# Altium schematic sheet Chargeur.SchDoc
size A4; PageSetup: Record=PageOptions|CenterHorizontal=True|CenterVertical=True|PrintScale=0.97|XCorrection=1.00|YCorrection=1.00|PrintKind=1|BorderSize=5000000|LeftOffset=0|BottomOffset=0|Orientation=2|PaperLength=1000|PaperWidth=1000|Scale=100|PaperSource=7|PrintQuality=-3|MediaType=1|DitherType=10|PrintScaleMode=1|PaperKind=A4 (210 x 297 mm)|PaperIndex=9
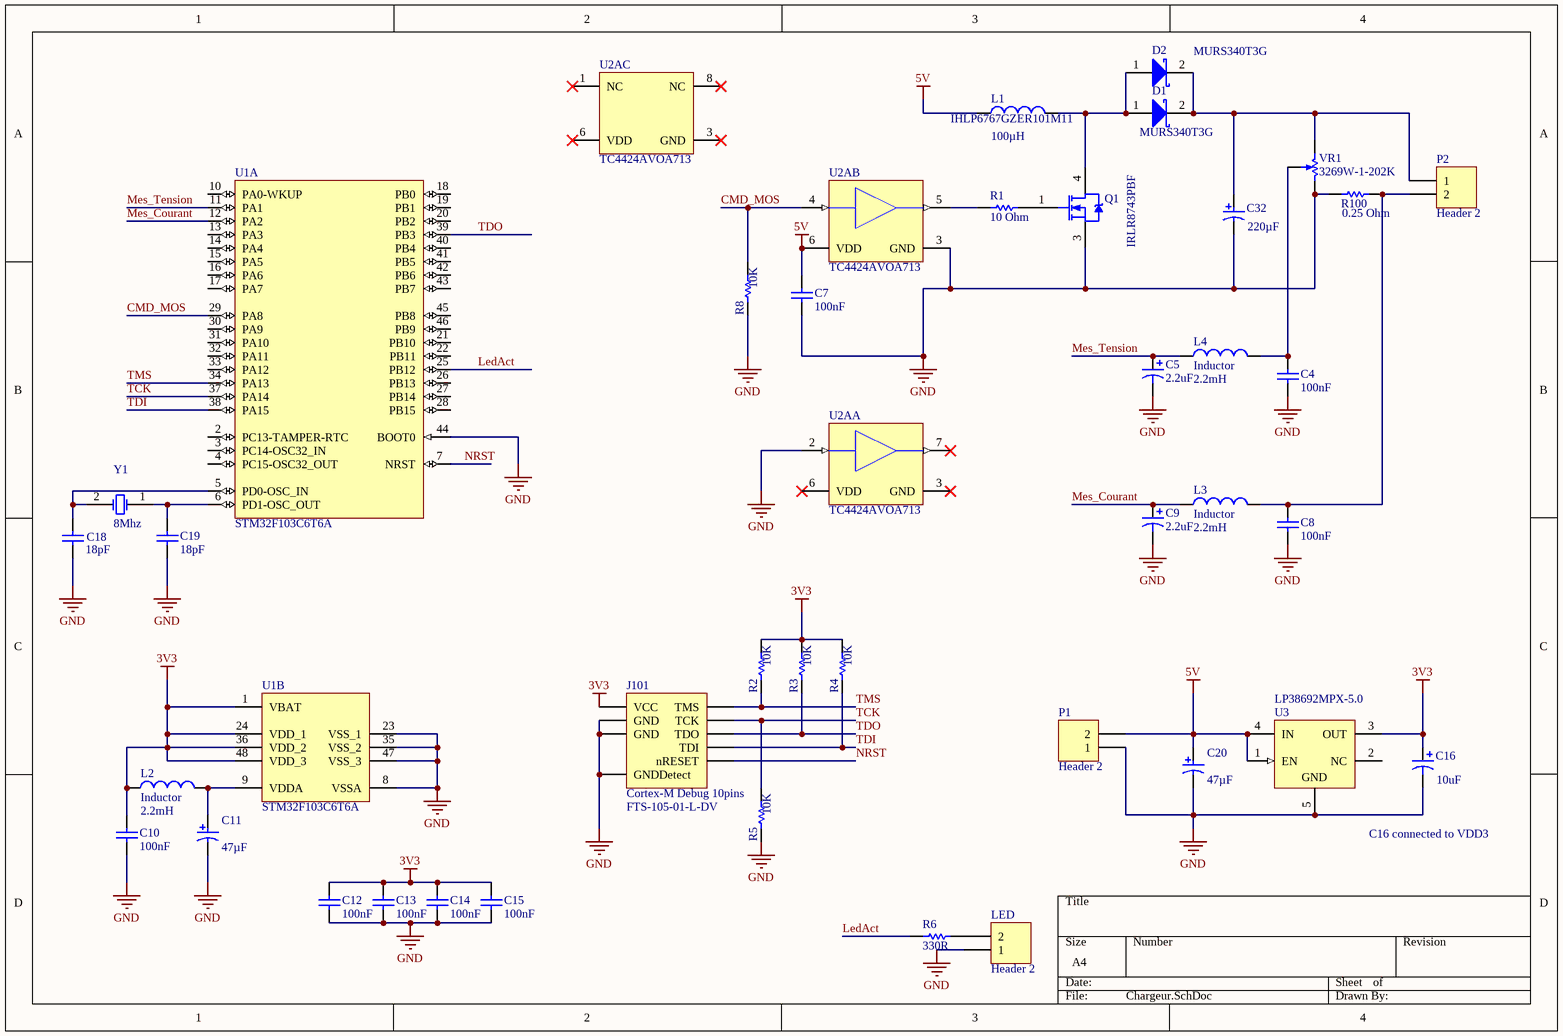
[diagram p0: Chargeur.SchDoc]

## Parts
C4  value 100nF  [CAPC1206(3216)100_L]  (hidden comment: CAP 100nF 25V 1206(3216))
C5  value 2.2uF  [B]  (hidden comment: CC475B004M)
C7  value 100nF  [CAPC1206(3216)100_L]  (hidden comment: CAP 100nF 25V 1206(3216))
C8  value 100nF  [CAPC1206(3216)100_L]  (hidden comment: CAP 100nF 25V 1206(3216))
C9  value 2.2uF  [B]  (hidden comment: CC475B004M)
C10  value 100nF  [CAPC1206(3216)100_L]  (hidden comment: CAP 100nF 25V 1206(3216))
C11  value 47µF  [VISH-7343-31_M]  (hidden comment: 293D476X9016D2TE3)
C12  value 100nF  [CAPC1206(3216)100_L]  (hidden comment: CAP 100nF 25V 1206(3216))
C13  value 100nF  [CAPC1206(3216)100_L]  (hidden comment: CAP 100nF 25V 1206(3216))
C14  value 100nF  [CAPC1206(3216)100_L]  (hidden comment: CAP 100nF 25V 1206(3216))
C15  value 100nF  [CAPC1206(3216)100_L]  (hidden comment: CAP 100nF 25V 1206(3216))
C16  value 10uF  [C]  (hidden comment: 194D335X0015C2)
C18  value 18pF  [CAPC1206(3216)100_L]  (hidden comment: CAP 100nF 25V 1206(3216))
C19  value 18pF  [CAPC1206(3216)100_L]  (hidden comment: CAP 100nF 25V 1206(3216))
C20  value 47µF  [VISH-7343-31_M]  (hidden comment: 293D476X9016D2TE3)
C32  value 220µF  [VISH-7343-31_M]  (hidden comment: 293D476X9016D2TE3)
D1  MURS340T3G  [VISH-DO-214AB-2_V]
D2  MURS340T3G  [VISH-DO-214AB-2_V]
J101  Cortex-M Debug 10pins  Comment2: FTS-105-01-L-DV  [2199SB-10G-301523]
L1  IHLP6767GZER101M11  value 100µH  [IHLP-6767GZ-11]
L2  Inductor  value 2.2mH  [INDC3216AL]
L3  Inductor  value 2.2mH  [INDC3216AL]
L4  Inductor  value 2.2mH  [INDC3216AL]
LED  Header 2  [HDR1X2]
P1  Header 2  [HDR1X2]
P2  Header 2  [HDR1X2]
Q1  IRLR8743PBF  [TO-252AA_N]
R1  value 10 Ohm  [RESC1206(3216)_N]  (hidden comment: 470R 5% 1206(3216))
R2  10K  [RESC1206(3216)_M]
R3  10K  [RESC1206(3216)_M]
R4  10K  [RESC1206(3216)_M]
R5  10K  [RESC1206(3216)_M]
R6  value 330R  [RESC1206(3216)_M]  (hidden comment: 10K)
R8  10K  [RESC1206(3216)_M]
R100  0.25 Ohm  [RESC2010(5025)_L]
U1  STM32F103C6T6A  [STM-LQFP48_M]  (parts A,B of 2)
U2A  TC4424AVOA713  [SOIC-OA8_N]  (parts A,B,C of 3)
U3  LP38692MPX-5.0  [MP05A_M]
VR1  3269W-1-202K  [3269W]
Y1  value 8Mhz  [HC49/4H_SMX]  (hidden comment: HC49/4H_SMX)

## Nets
3V3: C10.2 C12.2 C13.2 C14.2 C15.2 C16.1 J101.1(VCC) L2.1 R2.2 R3.2 R4.2 U1.1(VBAT) U1.24(VDD_1) U1.36(VDD_2) U1.48(VDD_3) U3.3(OUT)
5V: C7.2 C20.1 L1.1 P1.2 U2A.6(VDD) U3.1(EN) U3.4(IN)
GND: C4.1 C5.2 C7.1 C8.1 C9.2 C10.1 C11.2 C12.1 C13.1 C14.1 C15.1 C16.2 C18.1 C19.1 C20.2 C32.2 J101.3(GND) J101.5(GND) J101.9(GNDDetect) LED.1 P1.1 Q1.3(S) R5.1 R8.1 R100.1 U1.8(VSSA) U1.23(VSS_1) U1.35(VSS_2) U1.44(BOOT0) U1.47(VSS_3) U2A.2(INA) U2A.3(GND) U3.5(GND) VR1.CCW(-)
CMD_MOS: R8.2 U1.29(PA8) U2A.4(INB)
LedAct: R6.2 U1.25(PB12)
Mes_Courant: C9.1 L3.1 U1.12(PA2)
Mes_Tension: C5.1 L4.1 U1.11(PA1)
NRST: J101.10(nRESET) U1.7(NRST)
TCK: J101.4(TCK) R5.2 U1.37(PA14)
TDI: J101.8(TDI) R4.1 U1.38(PA15)
TDO: J101.6(TDO) R3.1 U1.39(PB3)
TMS: J101.2(TMS) R2.1 U1.34(PA13)
NetC4_2: C4.2 L4.2 VR1.W
NetC8_2: C8.2 L3.2 P2.2 R100.2
NetC11_1: C11.1 L2.2 U1.9(VDDA)
NetC18_2: C18.2 U1.5(PD0-OSC_IN) Y1.2(OSC2)
NetC19_2: C19.2 U1.6(PD1-OSC_OUT) Y1.1(OSC1)
NetC32_1: C32.1 D1.2(K) D2.2(K) P2.1 VR1.CW(+)
NetD1_1: D1.1(A) D2.1(A) L1.2 Q1.4(D)
NetLED_2: LED.2 R6.1
NetQ1_1: Q1.1(G) R1.1
NetR1_2: R1.2 U2A.5(OUTB)

Not connected (* = marked no-connect by the designer): U1 2(PC13-TAMPER-RTC) 3(PC14-OSC32_IN) 4(PC15-OSC32_OUT) 10(PA0-WKUP) 13(PA3) 14(PA4) 15(PA5) 16(PA6) 17(PA7) 18(PB0) 19(PB1) 20(PB2) 21(PB10) 22(PB11) 26(PB13) 27(PB14) 28(PB15) 30(PA9) 31(PA10) 32(PA11) 33(PA12) 40(PB4) 41(PB5) 42(PB6) 43(PB7) 45(PB8) 46(PB9); U2A 1(NC)* 7(OUTA)* 8(NC)*; U3 2(NC)

## Notes on the sheet
- C16 connected to VDD3

## Library data of the parts
C4 C7 C8 C10 C12-C15 C18 C19 = CMP-1037-04193-1: CAP 100nF 25V ±10% 1206 (3216 Metric) Thickness 1mm SMD; Case-Metric: 3216; Tolerance: Â±10%; Case-EIA: 1206; Technology: SMT; Max Thickness: 1 mm; Rated Voltage: 25 V
C5 C9 = CC475B004M: Conformal Coated Solid Tantalum Chip Capacitor: Standard Range, 4.7uF, 20% Tolerance, 4 WVDC @ -55°C to +85°C, Surge = 5V; Note: See Data Sheet for full range of components; Published: 19-Mar-2004; DatasheetDocument: 21-Mar-2002; PackageReference: B; Publisher: Altium Limited; ComponentLink1Description: Manufacturer Link; ComponentLink1URL: http://www.vishay.com/; ComponentLink2Description: Datasheet; ComponentLink2URL: http://www.vishay.com/docs/43017/ccec.pdf
C11 C20 C32 = CMP-1666-00025-1: Tantalum Capacitor, 47 uF, +/- 10%, 16 V, -55 to 125 degC, 2917 (7343 Metric), RoHS, Tape and Reel; Voltage Rating (DC): 50 V; Resistance: 470 kohm; Tolerance: 1%; Power Rating: 100 mW; Case\Package: 0603; REACH SVHC: No SVHC; Min Operating Temperature: -55 degC; ComponentLink2URL: http://www.vishay.com/docs/40002/293d.pdf; ComponentLink2Description: Datasheet; PackageReference: 7343-31; Case Code (Metric): 1608; Height: 0.45 mm; Case Code (Imperial): 0603; Packaging: Tape and Reel; Length: 1.6 mm; ComponentLink1Description: Manufacturer URL; Package Quantity: 5000; ComponentLink1URL: http://www.vishay.com/; Pins: 2; Mount: Surface Mount; Max Operating Temperature: 155 degC; RoHSCompliant: true; PackageDescription: 2-Pin Surface Mount Device, Body 7.3 x 4.3 mm; Width: 0.8 mm; DatasheetVersion: Aug-16; Voltage Rating: 50 V
C16 = 194D335X0015C2: Midget Conformal Coated Solid Tantalum Chip Capacitor: 3.3uF, 20% Tolerance, 15 WVDC @ +85°C, Surge = 20V; Note: See Data Sheet for full range of components; Published: 19-Mar-2004; DatasheetDocument: 05-Jul-2002; PackageReference: C; Publisher: Altium Limited; ComponentLink1Description: Manufacturer Link; ComponentLink1URL: http://www.vishay.com/; ComponentLink2Description: Datasheet; ComponentLink2URL: http://www.vishay.com/docs/40000/194d.pdf
D1 D2 = CMP-1666-00013-4: High Voltage Surface Mount Schottky Rectifier, 3 A, -65 to 175 degC, 2-Pin SMD, RoHS, Tape and Reel; PackageReference: DO-214AB-2; RoHSCompliant: true; Pins: 2; Min Operating Temperature: -65 degC; Length: 7.11 mm; Max Operating Temperature: 175 degC; REACH SVHC: Unknown; PackageDescription: 2-Pin Surface Mount Device, Body 6.855 x 5.905 mm; Height: 2.42 mm; Packaging: Tape and Reel; DatasheetVersion: 12/2014; Mount: Surface Mount; Package Quantity: 850; Mounting Technology: Surface Mount
L1-L4 = Inductor: Code_IEC: 1005; Published: 8-Jun-2000; LatestRevisionDate: 29-May-2009; LatestRevisionNote: IPC-7351 Footprint Added.; PackageReference: 0402-A; Publisher: Altium Limited; PackageDescription: Chip Inductor; Code_JEITA: 0402
LED P1 P2 = Header 2: Header, 2-Pin; LatestRevisionDate: 17-Jul-2002; LatestRevisionNote: Re-released for DXP Platform.; Publisher: Altium Limited
Q1 = IRFR13N20D: HEXFET Power MOSFET; Note: Pin 2 is trimmed and not drawn; Published: 17-Sep-2003; LatestRevisionDate: 20-Nov-2009; LatestRevisionNote: IPC-7351 Footprint Added.; DatasheetVersion: 14-Feb-2000; PackageVersion: Feb-2003; PackageReference: TO-252AA; Publisher: Altium Limited; PackageDescription: 3-Pin HEXFET Package 2.28 mm Pitch, 9.9 mm Lead Span; Code_JEDEC: TO-252-AA; ComponentLink1Description: Manufacturer Link; ComponentLink1URL: http://www.irf.com/; ComponentLink2Description: Datasheet; ComponentLink2URL: http://www.irf.com/product-info/datasheets/data/irfr13n20d.pdf
R1 = CMP-1014-00066-1: 470R 0.25W 5% 1206 (3216 Metric)  SMD; Case-Metric: 3216; Case-EIA: 1206; Tolerance: 5 %; Power: 0.25 W; Technology: SMT
R2-R6 R8 = CMP-1014-00098-1: 10K 0.25W 5% 1206 (3216 Metric)  SMD; Case-Metric: 3216; Case-EIA: 1206; Power: 0.25 W; Tolerance: 5 %; Technology: SMT
  R2-R5 R8: Value: 10K
R100 = CMP-1017-00002-1: 1R 0.75W 5% 2010 (5025 Metric)  SMD; Case-Metric: 5025; Case-EIA: 2010; Tolerance: 5 %; Technology: SMT; Power: 0.75 W; Value: 0.25 Ohm
U1 = CMP-0237-00254-3: ARM Cortex-M3 32-bit MCU, 32 KB Flash, 10 KB Internal RAM, 37 I/Os, 48-pin LQFP, -40 to 85 degC, Tray; Operating Frequency(F) (Processor speed) (MHz): 72; A/D Converter: 2x12-bit (10 Channel); Supply Voltage(Vcc) min (V): 2; FLASH Size (Prog) (kB): 32; I/Os (High Current): 37; Internal RAM Size (kB): 10; PackageVersion: Rev. 6, 06/2013; ComponentLink3Description: Package Specification; ComponentLink2URL: http://www.st.com/st-web-ui/static/active/en/resource/technical/document/datasheet/CD00210843.pdf; ComponentLink1URL: http://www.st.com/web/en/home.html; PackageDescription: 48-Pin Low Profile Quad Flat Package, 7 x 7 mm Body, 0.5 mm Pitch; PartNumber: STM32F103C6T6A; ComponentLink3URL: http://www.st.com/st-web-ui/static/active/en/resource/technical/document/datasheet/DM00058181.pdf; PackageReference: LQFP48; Packing: Tray; ComponentLink2Description: Datasheet; Mounting Technology: Surface Mount; ComponentLink1Description: Manufacturer URL; Core: ARM Cortex-M3; DatasheetVersion: Rev. 6
U2A = TC4424AVOA713: 3A Dual High-Speed Power MOSFET Drivers, Non Inverting, Extended Temperature, Tape and Reel; Published: 29-Jan-2009; LatestRevisionDate: 01-Mar-2010; LatestRevisionNote: Sch Layout changed.; DatasheetVersion: revB, Apr-2007; PackageVersion: revBB, Aug-2009; PackageReference: SOIC-OA8; Publisher: Altium Limited; PackageDescription: 8-Lead Plastic Small Outline (OA) - Narrow, 3.90mm Body [SOIC]; Supplier 1: Digi-Key; Supplier Part Number 1: TC4424AVOA713-ND; Code_IPC: SOIC127P600-8; ComponentLink1Description: Datasheet; ComponentLink1URL: http://ww1.microchip.com/downloads/en/DeviceDoc/21998b.pdf; ComponentLink2Description: Packaging Specification; ComponentLink2URL: http://www.microchip.com/stellent/groups/techpub_sg/documents/packagingspec/en012702.pdf; ComponentLink3Description: Microchip.com Home; ComponentLink3URL: http://www.microchip.com/
U3 = CMP-0062-01830-1: 1A Low Dropout CMOS Linear Regulators, Stable with Ceramic Output Capacitors, 5-pin SOT-223; Manufacturer: National Semiconductor; CompType: LDO IC; PowerWise: Y; PackageTopMarking: XYTT*LJTB; RoHS: N; DatasheetVersion: May-2005; Code_JEDEC: TO-261-AB; PackageReference: MP05A; PackageDescription: Moldec SOT-223, 6.50 x 3.56 x 1.6mm Body, 5 Lead, 1.5mm Pitch; Code_IPC: SOT223-5; PackageVersion: revA, Jan-2000; PinCount: 5
VR1 = RPot SM: Square Trimming Potentiometer; Published: 17-Dec-2003; DatasheetVersion: Oct-2003; PackageReference: POT4MM-2; Publisher: Altium Limited; ComponentLink1Description: Manufacturer Link; ComponentLink1URL: http://bourns.com/2/search.html
Y1 = HC49/4H_SMX: Surface Mount Quartz Crystal; Note: PCB layout complies with manufacturer's recommendation.; Published: 17-Jul-2002; DatasheetDocument: 18-Oct-1999; PackageDocument: 18-Oct-1999; PackageReference: HC49/4H_SMX; Publisher: Altium Limited; ComponentLink1Description: Manufacturer Link; ComponentLink1URL: http://www.cmac.com/mt/; ComponentLink2Description: Datasheet; ComponentLink2URL: http://www.cmac.com/mt/databook/crystals/smd/hc49_4h_smx.pdf
J101 = Cortex-M Debug 10pins: Distributeur: Farnell : 1667729